# Altium schematic sheet VOLTAGE_MONITOR.SchDoc: Voltage Monitor
size A3; DocumentNumber: 11; SheetNumber: 11; SheetTotal: 12
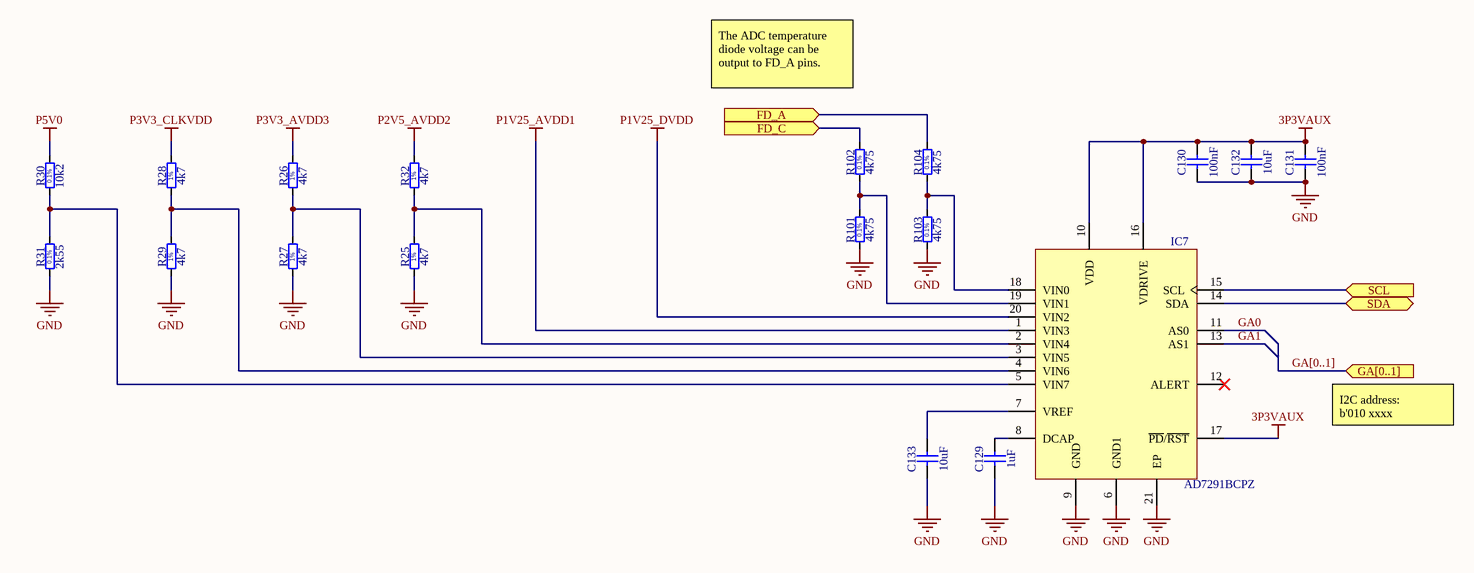
[diagram p0: VOLTAGE_MONITOR.SchDoc]

## Parts
C129  1uF  [CAPC1005X55N]
C130  100nF  [CAPC0603X33N]
C131  100nF  [CAPC0603X33N]
C132  10uF  [CAPC1608X87N]
C133  10uF  [CAPC1608X87N]
IC7  AD7291BCPZ  [CP_20_8]
R25  4k7  [RESC1005X40N]
R26  4k7  [RESC1005X40N]
R27  4k7  [RESC1005X40N]
R28  4k7  [RESC1005X40N]
R29  4k7  [RESC1005X40N]
R30  10k2  [RESC1608X55N]
R31  2k55  [RESC1608X55N]
R32  4k7  [RESC1005X40N]
R101  4k75  [RESC1005X35N]
R102  4k75  [RESC1005X35N]
R103  4k75  [RESC1005X35N]
R104  4k75  [RESC1005X35N]

## Ports
FD_A (in), FD_C (in), GA[0..1] (in), SCL (in), SDA (bidir)

## Nets
3P3VAUX: C130.2 C131.2 C132.2 IC7.10(VDD) IC7.16(VDRIVE) IC7.17(~{PD}/~{RST})
GND: C129.1 C130.1 C131.1 C132.1 C133.1 IC7.6(GND1) IC7.9(GND) IC7.21(EP) R25.1 R27.1 R29.1 R31.1 R101.1 R103.1
P1V25_AVDD1: IC7.1(VIN3)
P1V25_DVDD: IC7.20(VIN2)
P2V5_AVDD2: R32.2
P3V3_AVDD3: R26.2
P3V3_CLKVDD: R28.2
P5V0: R30.2
FD_A: R104.2 ; port FD_A
FD_C: R102.2 ; port FD_C
GA0: IC7.11(AS0)
GA1: IC7.13(AS1)
SCL: IC7.15(SCL) ; port SCL
SDA: IC7.14(SDA) ; port SDA
NetC129_2: C129.2 IC7.8(DCAP)
NetC133_2: C133.2 IC7.7(VREF)
NetIC7_2: IC7.2(VIN4) R25.2 R32.1
NetIC7_3: IC7.3(VIN5) R26.1 R27.2
NetIC7_4: IC7.4(VIN6) R28.1 R29.2
NetIC7_5: IC7.5(VIN7) R30.1 R31.2
NetIC7_18: IC7.18(VIN0) R103.2 R104.1
NetIC7_19: IC7.19(VIN1) R101.2 R102.1

Not connected (* = marked no-connect by the designer): IC7 12(ALERT)*

## Buses and harness runs
bus GA[0..1] = port GA[0..1]

## Notes on the sheet
- The ADC temperature diode voltage can be output to FD_A pins.
- I2C address:
  b'010 xxxx
- Title
- Size:
- Date:
- A3
- Number:
- Revision:
- Sheet
- of
- Drawn by:
- File:
- (in symbol R0402_4K7_1%_0.0625W_100PPM) 1%
- (in symbol R0402_4K75_0.1%_0.063W_25PPM) 0.1%
- (in symbol R0603_2K55_0.1%_0.063W_10PPM) 0.1%
- (in symbol R0603_10K2_0.1%_0.063W_10PPM) 0.1%

## Library data of the parts
C129 = CC0402_1UF_16V_10%_X5R: Non-polarised capacitor; Part Description: SMD Multilayer Chip Ceramic Capacitor; Manufacturer: GENERIC; Manufacturer1 Part Number: C1005X5R1C105KT; Tolerance: ±10%; Voltage: 16V; TC: X5R; Value: 1uF; Part Number: CC0402_1UF_16V_10%_X5R; Component Kind: Standard; Component Type: Standard; Pin Count: 2; Status: Preferred; Manufacturer Part Number: CC0402_1UF_16V_10%_X5R; Case: 0402; Mounted: Yes; Socket: No; SMD: Yes; Sense: No; Manufacturer1 Example: TDK; Manufacturer1 ComponentHeight: 0.55mm; HelpURL: \\cern.ch\dfs\Applications\Altium\Datasheets\CC0402_X5R_TDK_C.pdf; Author: CERN DEM JLC; CreateDate: 25.10.2012; LatestRevisionDate: 25.10.2012
C130 C131 = CC0201_100NF_6.3V_10%_X5R: Non-polarised capacitor; Part Description: SMD Multilayer Chip Ceramic Capacitor; Manufacturer: GENERIC; Manufacturer1 Part Number: 02016D104KAT2A; Tolerance: ±10%; Voltage: 6.3V; TC: X5R; Value: 100nF; Part Number: CC0201_100NF_6.3V_10%_X5R; Component Kind: Standard; Component Type: Standard; Pin Count: 2; Status: Not Recommended; Manufacturer Part Number: CC0201_100NF_6.3V_10%_X5R; Case: 0201; Mounted: Yes; Socket: No; SMD: Yes; Sense: No; Manufacturer1 Example: AVX; Manufacturer1 ComponentHeight: 0.33mm; HelpURL: \\cern.ch\dfs\Applications\Altium\Datasheets\CC0201_X5R_AVX.pdf; Author: CERN DEM JLC; CreateDate: 03.12.2007; LatestRevisionDate: 03.12.2007
C132 C133 = CC0603_10UF_6.3V_20%_X5R: Non-polarised capacitor; Part Description: SMD Multilayer Chip Ceramic Capacitor; Manufacturer: GENERIC; Manufacturer1 Part Number: C0603C106M9PAC; Tolerance: ±20%; Voltage: 6.3V; TC: X5R; Value: 10uF; Part Number: CC0603_10UF_6.3V_20%_X5R; Component Kind: Standard; Component Type: Standard; Pin Count: 2; Status: Preferred; Manufacturer Part Number: CC0603_10uF_6.3V_20%_X5R; Case: 0603; Mounted: Yes; Socket: No; SMD: Yes; Sense: No; Manufacturer1 Example: KEMET; Manufacturer1 ComponentHeight: 0.95mm; HelpURL: \\cern.ch\dfs\Applications\Altium\Datasheets\CC0603_X5R_KEMET.pdf; Author: CERN DEM JLC; CreateDate: 03.12.2007; LatestRevisionDate: 03.12.2007
IC7 = AD7291BCPZ: 8-Channel, I2C, 12-Bit SAR ADC with Temperature Sensor; Generic Part Number: AD7291; Manufacturer: Analog Devices; Packing: Tray; Throughput Rate (SPS): 22.2K; Resolution (Bits): 12; Interface: I2C/Ser 2-Wire, Ser; Channels: 8; ComponentLink3Description: Package Specification; ComponentLink1Description: Manufacturer URL; Code_JEDEC: MO-220-WGGD; RoHS: Y; ComponentLink4URL: http://www.analog.com/en/analog-to-digital-converters/ad-converters/ad7291/products/product.html; PackageDescription: 20-Lead Lead Frame Chip Scale Package [LFCSP_WQ] 4 x 4 mm Body, Very Very Thin Quad; ComponentLink2Description: Datasheet; PackageReference: CP-20-8; ComponentLink2URL: http://www.analog.com/static/imported-files/data_sheets/AD7291.pdf; ComponentLink4Description: Product URL; ComponentLink3URL: http://www.analog.com/static/imported-files/packages/PKG_PDF/LFCSP(CP)/CP-20/CP_20_8.pdf; PackageVersion: 020509-B; ComponentLink1URL: http://www.analog.com/en/index.html; Mounting Technology: Surface Mount; Manufacturer Part Number: AD7291BCPZ
R25-R29 R32 = R0402_4K7_1%_0.0625W_100PPM: Resistor - 1%; Part Description: General Purpose Thick Film Chip Resistor; Manufacturer: GENERIC; Manufacturer1 Part Number: 232270674702L; TC: ±100ppm/°C; Value: 4k7; Power: 0.0625W; Tolerance: ±1%; Part Number: R0402_4K7_1%_0.0625W_100PPM; Component Kind: Standard; Component Type: Standard; Pin Count: 2; Status: Not recommended; Manufacturer Part Number: R0402_4K7_1%_0.0625W_100PPM; Case: 0402; Mounted: Yes; Sense: No; Socket: No; SMD: Yes; Manufacturer1 Example: YAGEO PHYCOMP; Manufacturer1 ComponentHeight: 0.4mm; HelpURL: \\cern.ch\dfs\Applications\Altium\Datasheets\R0402_Phycomp_RC0402.pdf; Author: CERN DEM JLC; CreateDate: 03.12.2007; LatestRevisionDate: 17.10.2012
R30 = R0603_10K2_0.1%_0.063W_10PPM: Resistor - 0.1%; Part Description: Thin Film Chip Resistor; Manufacturer: GENERIC; Manufacturer1 Part Number: RN73C1J10K2BTDF; Power: 0.063W; TC: ±10ppm; Part Number: R0603_10K2_0.1%_0.063W_10PPM; Component Kind: Standard; Component Type: Standard; Pin Count: 2; Value: 10k2; Status: Not recommended; Tolerance: ±0.1%; Manufacturer Part Number: R0603_10K2_0.1%_0.063W_10PPM; Case: 0603; Mounted: Yes; Sense: No; Socket: No; SMD: Yes; Manufacturer1 Example: TYCO HOLSWORTHY; Manufacturer1 ComponentHeight: 0.5mm; HelpURL: \\cern.ch\dfs\Applications\Altium\Datasheets\R0603_Tyco_RN73.pdf; Author: CERN DEM JLC; CreateDate: 03.12.2007; LatestRevisionDate: 13.03.2008
R31 = R0603_2K55_0.1%_0.063W_10PPM: Resistor - 0.1%; Part Description: Thin Film Chip Resistor; Manufacturer: GENERIC; Manufacturer1 Part Number: RN73C1J2K55BTDF; Power: 0.063W; TC: ±10ppm; Part Number: R0603_2K55_0.1%_0.063W_10PPM; Component Kind: Standard; Component Type: Standard; Pin Count: 2; Value: 2k55; Status: Not recommended; Tolerance: ±0.1%; Manufacturer Part Number: R0603_2K55_0.1%_0.063W_10PPM; Case: 0603; Mounted: Yes; Sense: No; Socket: No; SMD: Yes; Manufacturer1 Example: TYCO HOLSWORTHY; Manufacturer1 ComponentHeight: 0.5mm; HelpURL: \\cern.ch\dfs\Applications\Altium\Datasheets\R0603_Tyco_RN73.pdf; Author: CERN DEM JLC; CreateDate: 03.12.2007; LatestRevisionDate: 13.03.2008
R101-R104 = R0402_4K75_0.1%_0.063W_25PPM: Resistor - 0.1%; Part Description: Thin Film Precision Resistor; Manufacturer: GENERIC; Manufacturer1 Part Number: CPF0402B4K75E1; Power: 0.063W; TC: ±25ppm/°C; Part Number: R0402_4K75_0.1%_0.063W_25PPM; Component Kind: Standard; Component Type: Standard; Pin Count: 2; Value: 4k75; Status: Not Recommended; Tolerance: ±0.1%; Manufacturer Part Number: R0402_4K75_0.1%_0.063W_25PPM; Case: 0402; Mounted: Yes; Sense: No; Socket: No; SMD: Yes; Manufacturer1 Example: TE CONNECTIVITY; Manufacturer1 ComponentHeight: 0.35mm; HelpURL: \\cern.ch\dfs\Applications\Altium\Datasheets\R0402_TYCO_CPF.pdf; Author: CERN DEM JMW; CreateDate: 22.09.2015; LatestRevisionDate: 22.09.2015